# EasyEDA Pro project ProPrj_辅助电源模块_2026-01-25.epro

# Schematic 2023-A题-单相逆变器并联运行系统-106B电赛复兴团队
Board Name: 2023-A题-单相逆变器并联运行系统-106B电赛复兴团队; Create Date: 2025-06-02; Page Name: 辅助电源模块; Project Name: 辅助电源模块; Schematic Name: 2023-A题-单相逆变器并联运行系统-106B电赛复兴团队; Update Date: 2025-06-02; Add into BOM: yes; Company: Your Company; Convert to PCB: yes; Date: 2023-08-06; Draw By: interstellarone; REV: 1.0; Sheet: 1/1; spicePre: .
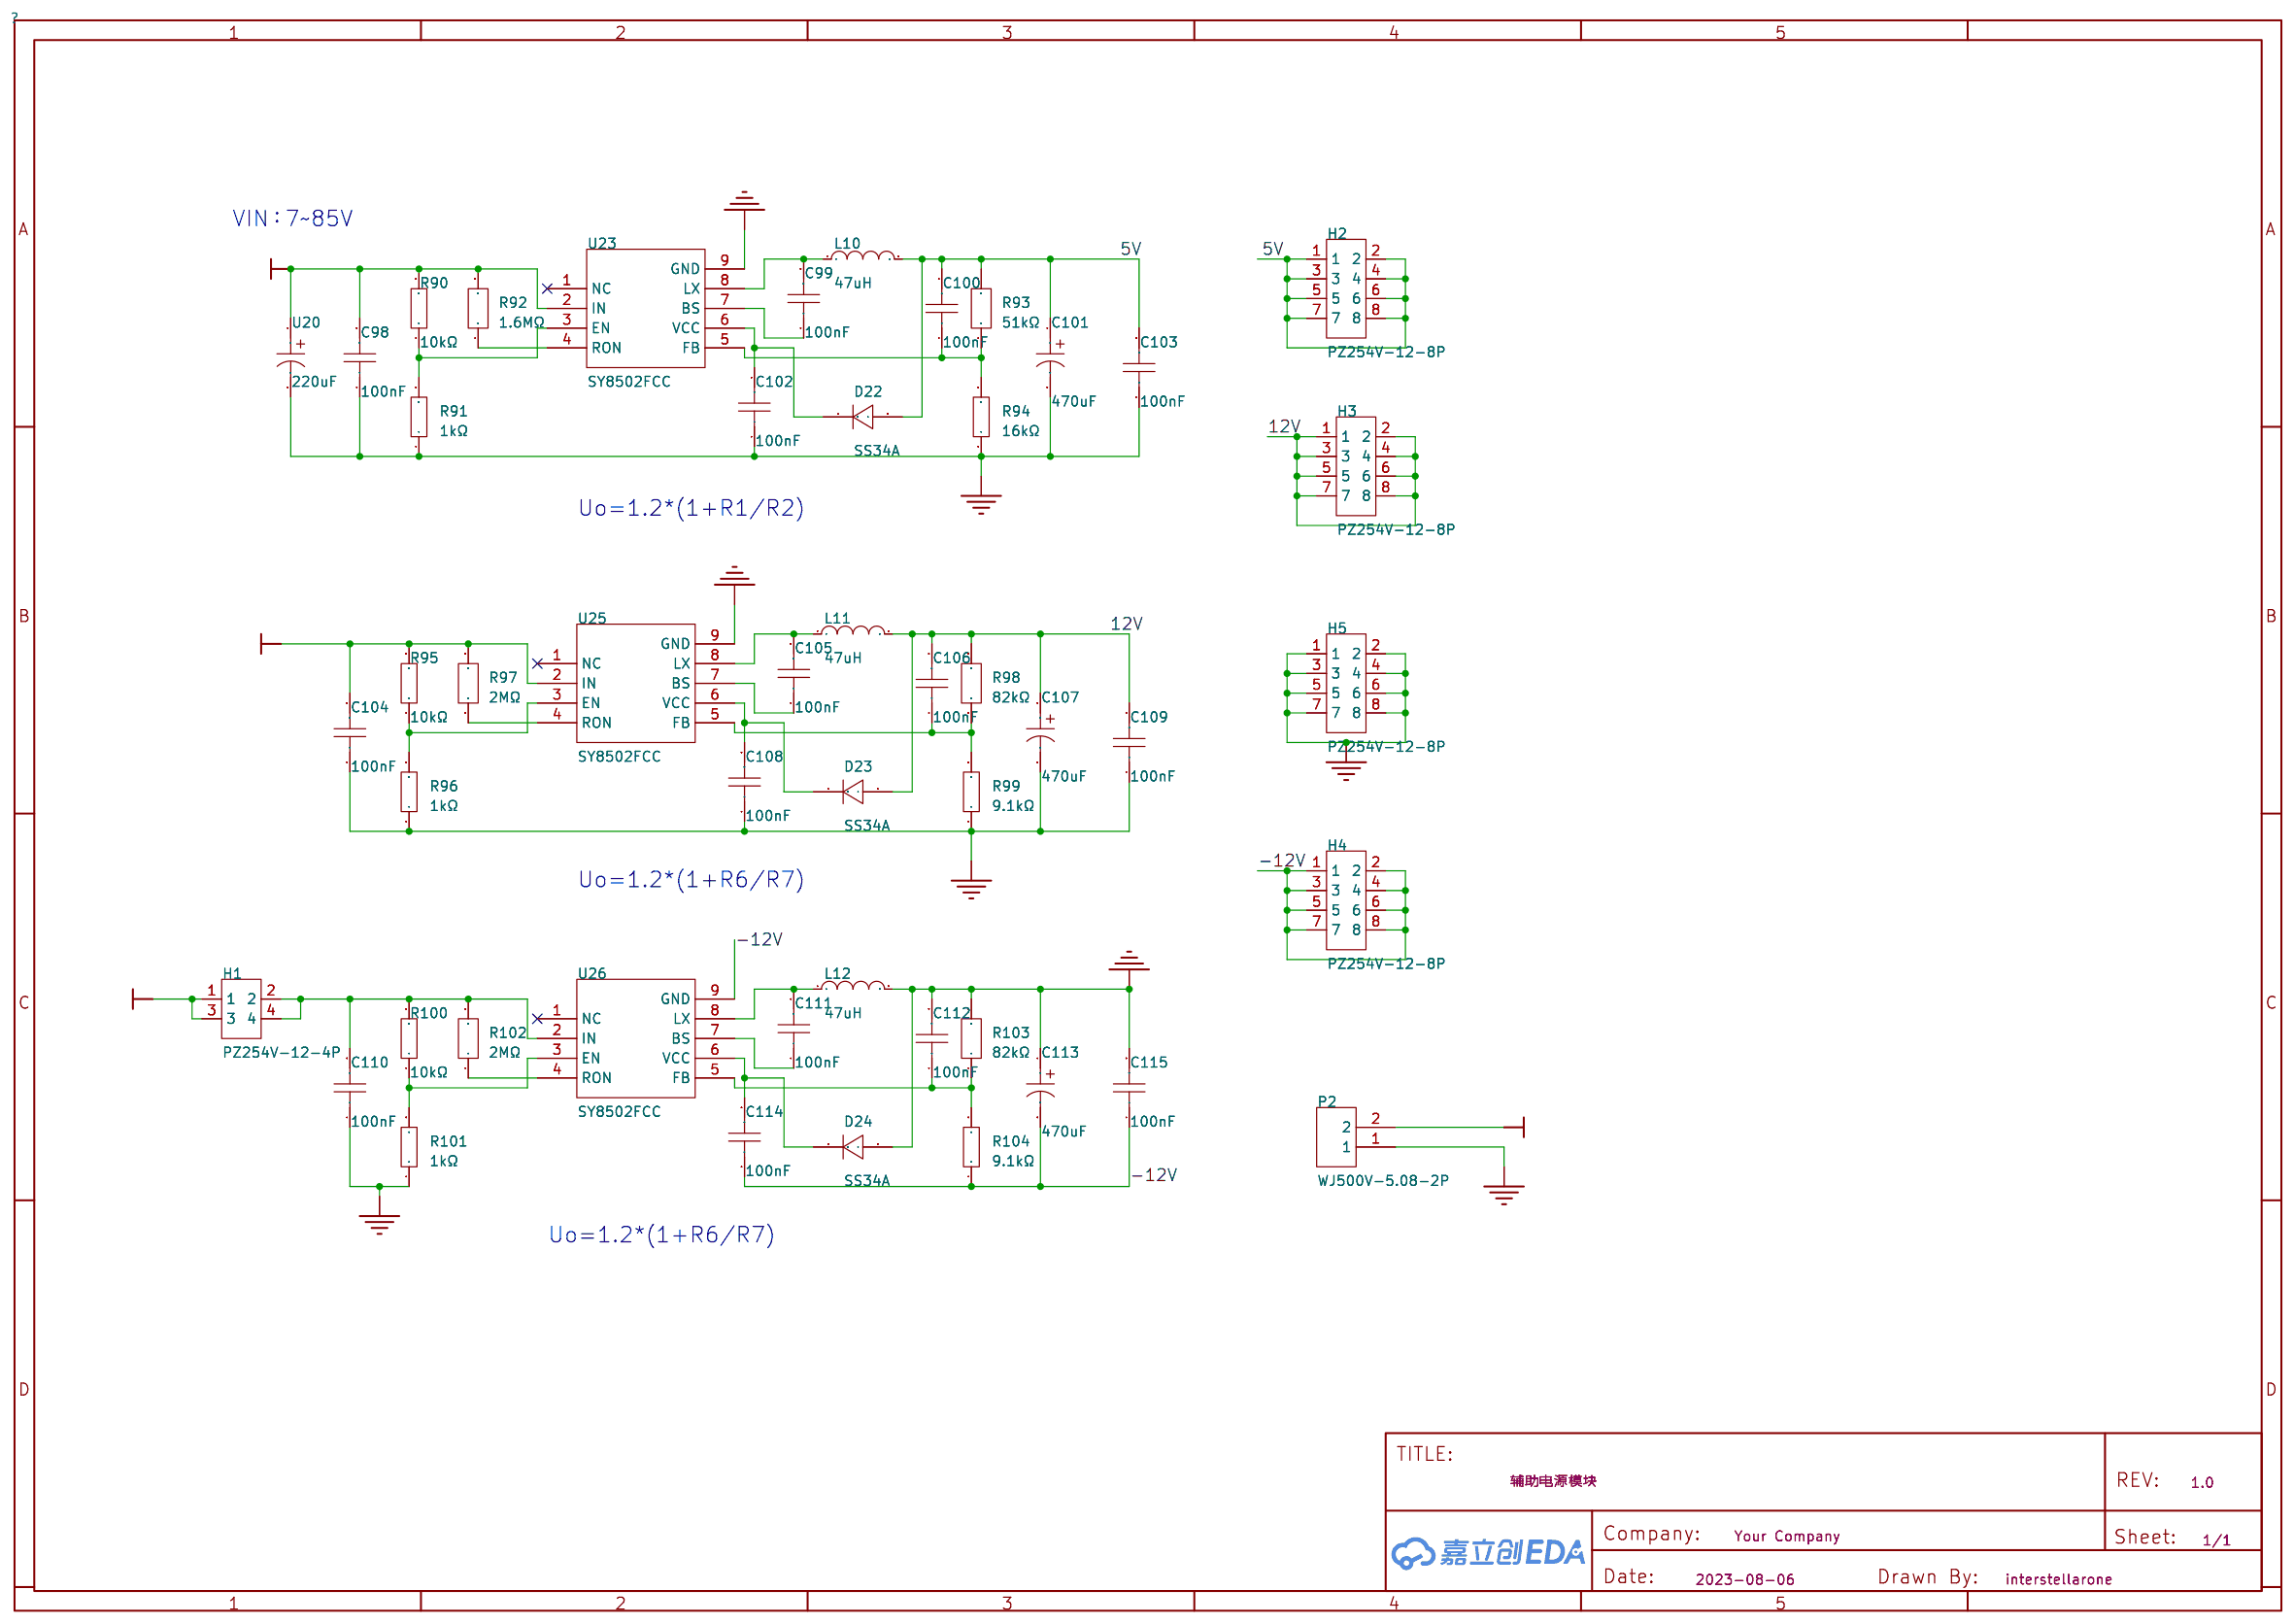
[diagram p0: schematic sheet]

## Parts
C98  100nF  [C0603]
C99  100nF  [C0603]
C100  100nF  [C0603]
C101  470uF  [CAP-TH_BD6.0-P2.50-D0.5-FD]
C102  100nF  [C0603]
C103  100nF  [C0603]
C104  100nF  [C0603]
C105  100nF  [C0603]
C106  100nF  [C0603]
C107  470uF  [CAP-TH_BD6.0-P2.50-D0.5-FD]
C108  100nF  [C0603]
C109  100nF  [C0603]
C110  100nF  [C0603]
C111  100nF  [C0603]
C112  100nF  [C0603]
C113  470uF  [CAP-TH_BD6.0-P2.50-D0.5-FD]
C114  100nF  [C0603]
C115  100nF  [C0603]
D22  SS34A  [SMA_L4.3-W2.6-LS5.2-RD]
D23  SS34A  [SMA_L4.3-W2.6-LS5.2-RD]
D24  SS34A  [SMA_L4.3-W2.6-LS5.2-RD]
H1  PZ254V-12-4P  [HDR-TH_4P-P2.54-V-M-R2-C2-S2.54]
H2  PZ254V-12-8P  [HDR-TH_8P-P2.54-V-M-R2-C4-S2.54]
H3  PZ254V-12-8P  [HDR-TH_8P-P2.54-V-M-R2-C4-S2.54]
H4  PZ254V-12-8P  [HDR-TH_8P-P2.54-V-M-R2-C4-S2.54]
H5  PZ254V-12-8P  [HDR-TH_8P-P2.54-V-M-R2-C4-S2.54]
L10  47uH  [IND-SMD_L7.0-W6.6_FXL0630]
L11  47uH  [IND-SMD_L7.0-W6.6_FXL0630]
L12  47uH  [IND-SMD_L7.0-W6.6_FXL0630]
P2  WJ500V-5.08-2P  [CONN-TH_2P-P5.00_WJ500V-5.08-2P]
R90  10kΩ  [R0603]
R91  1kΩ  [R0603]
R92  1.6MΩ  [R0603]
R93  51kΩ  [R0603]
R94  16kΩ  [R0603]
R95  10kΩ  [R0603]
R96  1kΩ  [R0603]
R97  2MΩ  [R0603]
R98  82kΩ  [R0603]
R99  9.1kΩ  [R0603]
R100  10kΩ  [R0603]
R101  1kΩ  [R0603]
R102  2MΩ  [R0603]
R103  82kΩ  [R0603]
R104  9.1kΩ  [R0603]
U20  220uF  [CAP-TH_BD12.5-P5.00-D0.6-FD]
U23  SY8502FCC  [SOIC-8_L4.9-W3.9-P1.27-LS6.0-BL-EP]
U25  SY8502FCC  [SOIC-8_L4.9-W3.9-P1.27-LS6.0-BL-EP]
U26  SY8502FCC  [SOIC-8_L4.9-W3.9-P1.27-LS6.0-BL-EP]

## Library data of the parts
C98-C100 C102-C106 C108-C112 C114 C115 = CGA0603X7R104K500JT: 容值:100nF;精度:±10%;额定电压:50V;温度系数:X7R;; LCSC Part Name: 100nF ±10% 50V; Supplier Part: C6119867; Manufacturer: HRE(芯声); Supplier Footprint: 0603; JLCPCB Part Class: 扩展库; Datasheet: https://atta.szlcsc.com/upload/public/pdf/source/20250103/C44077DA9E7B3EFAE02F22B6D3D1CBC9.pdf; Supplier: LCSC; Tolerance: ±10%; Voltage Rating: 50V; Temperature Coefficient: X7R
C101 C107 C113 = CD110477M1A0607VFL: 容值:470uF;额定电压:10V;; LCSC Part Name: 470uF 10V; Supplier Part: C7499930; Manufacturer: HRK(鸿瑞凯电子); Supplier Footprint: 插件,D6xL7mm; JLCPCB Part Class: 扩展库; Supplier: LCSC; Rated Voltage: 10V; φD: 6mm; L: 7mm
D22-D24 = SS34A_C211775: 正向压降(Vf):500mV@3A;直流反向耐压(Vr):40V;整流电流:3A;; LCSC Part Name: 电压:40V 电流:3A; Supplier Part: C211775; Manufacturer: YANGJIE(扬杰); Supplier Footprint: SMA(DO-214AC); JLCPCB Part Class: 扩展库; Datasheet: https://atta.szlcsc.com/upload/public/pdf/source/20221024/B9020E516EC6DC8CDE89FB2DDED1354C.pdf; Supplier: LCSC; Forward Voltage (Vf@If): 500mV@3A; Reverse Voltage (Vr): 40V; Rectified Current: 3A; Reverse Leakage Current (Ir): 500uA@40V
H1 = PZ254V-12-4P: 插针结构:2x2P;间距:2.54mm;行距:2.54mm;圆针/方针:方针;安装方式:直插;排数:双排;总PIN位数:4P;额定电流:-;额定电压:-;配合针长度:6mm;塑高:2.5mm;端接针长度:3mm;触头材质:黄铜;触头镀层:-;工作温度:-40℃~+105℃;颜色:黑色;; LCSC Part Name: 2x2P 间距:2.54mm 方针 直插; Supplier Part: C492419; Manufacturer: XFCN(兴飞); Supplier Footprint: 插件,P=2.54mm; JLCPCB Part Class: 扩展库; Datasheet: https://atta.szlcsc.com/upload/public/pdf/source/20200309/C492419_0001C06E73AFF21BD0ED3D7CEEF46D29.pdf; Supplier: LCSC; Pin Structure: 2x2P; Pitch: 2.54mm; Row Spacing: 2.54mm; Circluar Pins/Square Pins: 方针; Mounting Type: 直插; Number of Rows: 双排; Number of Pins: 4P; Length of Mating Pin: 6mm; Insulation Height: 2.5mm; Length of End Connection Pin: 3mm; Contact Material: 黄铜; Operating Temperature: -40℃~+105℃; Color: 黑色
H2-H5 = PZ254V-12-8P: 插针结构:2x4P;间距:2.54mm;行距:2.54mm;圆针/方针:方针;安装方式:直插;排数:双排;总PIN位数:8P;额定电流:-;额定电压:-;配合针长度:6mm;塑高:2.5mm;端接针长度:3mm;触头材质:黄铜;触头镀层:-;工作温度:-40℃~+105℃;颜色:黑色;; LCSC Part Name: 2x4P 间距:2.54mm 方针 直插; Supplier Part: C492421; Manufacturer: XFCN(兴飞); Supplier Footprint: 插件,P=2.54mm; JLCPCB Part Class: 扩展库; Datasheet: https://atta.szlcsc.com/upload/public/pdf/source/20200309/C492421_DC8A206AF99CD7755BD4A5B0BC48200B.pdf; Supplier: LCSC; Pin Structure: 2x4P; Pitch: 2.54mm; Row Spacing: 2.54mm; Circluar Pins/Square Pins: 方针; Mounting Type: 直插; Number of Rows: 双排; Number of Pins: 8P; Length of Mating Pin: 6mm; Insulation Height: 2.5mm; Length of End Connection Pin: 3mm; Contact Material: 黄铜; Operating Temperature: -40℃~+105℃; Color: 黑色
L10-L12 = FXL0630-470-M: 电感值:47uH;精度:±20%;额定电流:1.5A;饱和电流(Isat):2A;类型:一体成型电感;; LCSC Part Name: 47uH ±20% 2A; Supplier Part: C475913; Manufacturer: cjiang(长江微电); Supplier Footprint: SMD,6.6x7mm; JLCPCB Part Class: 扩展库; Datasheet: https://atta.szlcsc.com/upload/public/pdf/source/20240426/3189EA8206330E2108542F9E34E540E7.pdf; Supplier: LCSC; Tolerance: ±20%; Rated Current: 1.5A; Saturation Current (Isat): 2A; DC Resistance (DCR): 385mΩ; Type: 一体成型电感
P2 = WJ500V-5.08-2P: 结构:1x2P;间距:5.08mm;颜色:绿色;安装方式:直插;额定电流:18A;额定电压:250V;排数:1;线规 - AWG:14~30;线规 - 平方毫米:2.5;每排PIN数:2;触头材质:-;触头镀层:-;工作温度范围:-40℃~+105℃;焊接温度(最大值):-;; LCSC Part Name: 1x2P 5.08mm 直插 排数:1 每排P数:2; Supplier Part: C8465; Manufacturer: KANGNEX(康奈克斯电气); Supplier Footprint: 插件,P=5.08mm; JLCPCB Part Class: 扩展库; Datasheet: https://atta.szlcsc.com/upload/public/pdf/source/20191225/C8465_02D34CE5B5B4A53DF5891601D97FA9F4.pdf; Supplier: LCSC; Structure: 1x2P; Pitch: 5.08mm; Color: 绿色; Mounting Style: 直插; Current Rating (Max): 18A; Voltage Rating (Max): 250V; Number of Pins: 2P; Number of Rows: 1; Wire Gauge - AWG: 14~30; Wire Gauge - mm2: 2.5; Number of PINs Per Row: 2; Operating Temperature Range: -40℃~+105℃; Screw Specification: M2.5
R90 R95 R100 = 0603WAF1002T5E: 电阻类型:厚膜电阻;阻值:10kΩ;精度:±1%;功率:100mW;最大工作电压:75V;温度系数:±100ppm/℃;; LCSC Part Name: 厚膜电阻 10kΩ ±1% 100mW; Supplier Part: C25804; Manufacturer: UNI-ROYAL(厚声); Supplier Footprint: 0603; JLCPCB Part Class: 基础库; Datasheet: https://atta.szlcsc.com/upload/public/pdf/source/20200306/C422600_1E6D84923E4A46A82E41ADD87F860B5C.pdf; Supplier: LCSC; Type: 厚膜电阻; Tolerance: ±1%; Power(Watts): 100mW; Overload Voltage (Max): 75V; Temperature Coefficient: ±100ppm/℃; Operating Temperature Range: -55℃~+155℃
R91 R96 R101 = 0603WAF1001T5E: 电阻类型:厚膜电阻;阻值:1kΩ;精度:±1%;功率:100mW;最大工作电压:75V;温度系数:±100ppm/℃;; LCSC Part Name: 1kΩ ±1% 100mW 厚膜电阻; Supplier Part: C21190; Manufacturer: UNI-ROYAL(厚声); Supplier Footprint: 0603; JLCPCB Part Class: 基础库; Datasheet: https://atta.szlcsc.com/upload/public/pdf/source/20200306/C422600_1E6D84923E4A46A82E41ADD87F860B5C.pdf; Supplier: LCSC; Type: 厚膜电阻; Tolerance: ±1%; Power(Watts): 100mW; Overload Voltage (Max): 75V; Temperature Coefficient: ±100ppm/℃; Operating Temperature Range: -55℃~+155℃
R92 R97 R102 = FRC0603J165 TS: 电阻类型:厚膜电阻;阻值:1.6MΩ;精度:±5%;功率:100mW;最大工作电压:75V;温度系数:±100ppm/℃;; LCSC Part Name: 1.6MΩ ±5% 100mW 厚膜电阻; Supplier Part: C2933272; Manufacturer: FOJAN(富捷); Supplier Footprint: 0603; JLCPCB Part Class: 扩展库; Datasheet: https://atta.szlcsc.com/upload/public/pdf/source/20211221/925EC7D7225764EE0046F22065062C87.pdf; Supplier: LCSC; Type: 厚膜电阻; Tolerance: ±5%; Power(Watts): 100mW; Overload Voltage (Max): 75V; Temperature Coefficient: ±100ppm/℃; Operating Temperature Range: -55℃~+155℃
R93 R98 R103 = FRC0603F5102TS: 电阻类型:厚膜电阻;阻值:51kΩ;精度:±1%;功率:100mW;最大工作电压:75V;温度系数:±100ppm/℃;; LCSC Part Name: 51kΩ ±1% 100mW 厚膜电阻; Supplier Part: C2907049; Manufacturer: FOJAN(富捷); Supplier Footprint: 0603; JLCPCB Part Class: 扩展库; Datasheet: https://atta.szlcsc.com/upload/public/pdf/source/20211221/925EC7D7225764EE0046F22065062C87.pdf; Supplier: LCSC; Type: 厚膜电阻; Tolerance: ±1%; Power(Watts): 100mW; Overload Voltage (Max): 75V; Temperature Coefficient: ±100ppm/℃; Operating Temperature Range: -55℃~+155℃
R94 R99 R104 = 0603WAF1602T5E: 电阻类型:厚膜电阻;阻值:16kΩ;精度:±1%;功率:100mW;最大工作电压:75V;温度系数:±100ppm/℃;; LCSC Part Name: 16kΩ ±1% 100mW 厚膜电阻; Supplier Part: C4210; Manufacturer: UNI-ROYAL(厚声); Supplier Footprint: 0603; JLCPCB Part Class: 扩展库; Datasheet: https://atta.szlcsc.com/upload/public/pdf/source/20200306/C422600_1E6D84923E4A46A82E41ADD87F860B5C.pdf; Supplier: LCSC; Type: 厚膜电阻; Tolerance: ±1%; Power(Watts): 100mW; Overload Voltage (Max): 75V; Temperature Coefficient: ±100ppm/℃; Operating Temperature Range: -55℃~+155℃
U20 = ERJ1KM221W20OT: 容值:220uF;精度:±20%;额定电压:100V;; LCSC Part Name: 220uF ±20% 100V; Supplier Part: C5213780; Manufacturer: AISHI(艾华集团); Supplier Footprint: 插件,D12.5xL20mm; JLCPCB Part Class: 扩展库; Datasheet: https://atta.szlcsc.com/upload/public/pdf/source/20221026/FE9DE5870E7BB63CB4D24A5A37C2EC23.pdf; Supplier: LCSC; Tolerance: ±20%; Rated Voltage: 100V; Lead Spacing: 5mm; φD: 12.5mm; L: 20mm; Lifetime @ Temp: 10000hrs@105℃
U23 U25 U26 = SY8502FCC: 功能类型:降压型;输出类型:固定;工作电压:7V~85V;输出电压:5V;输出电流:1.2A;; LCSC Part Name: 高效率1.2A连续输出85V输入同步降压转换器; Supplier Part: C87752; Manufacturer: silergy(矽力杰); Supplier Footprint: SOIC-8-EP; JLCPCB Part Class: 扩展库; Datasheet: https://atta.szlcsc.com/upload/public/pdf/source/20170925/C87752_1506321754501990561.pdf; Supplier: LCSC; Function: 降压型; Output Type: 固定; Input Voltage: 7V~85V; Output Voltage: 5V; Output Current: 1.2A; Switching Frequency: 200kHz~500kHz; Operating Temperature: -40℃~+125℃; Synchronous Rectification: 是; Number of Outputs: 1; Topology: 降压式; Quiescent Current (Iq): 400uA; Switch tube (built-in/external): 内置

## Nets
5V: C100.2 C101.1 C103.2 D22.2(A) H2.1 H2.2 H2.3 H2.4 H2.5 H2.6 H2.7 H2.8 L10.2 R93.2
12V: C106.2 C107.1 C109.2 D23.2(A) H3.1 H3.2 H3.3 H3.4 H3.5 H3.6 H3.7 H3.8 L11.2 R98.2
-12V: C113.2 C114.1 C115.1 H4.1 H4.2 H4.3 H4.4 H4.5 H4.6 H4.7 H4.8 R104.1 U26.9(GND)
GND: C98.1 C101.2 C102.1 C103.1 C104.1 C107.2 C108.1 C109.1 C110.1 C112.2 C113.1 C115.2 D24.2(A) H5.1 H5.2 H5.3 H5.4 H5.5 H5.6 H5.7 H5.8 L12.2 P2.1 R91.1 R94.1 R96.1 R99.1 R101.1 R103.2 U20.2 U23.9(GND) U25.9(GND)
VCC: C98.2 C104.2 H1.1 H1.3 P2.2 R90.2 R92.2 R95.2 R97.2 U20.1 U23.2(IN) U25.2(IN)
$1N26: R90.1 R91.2 U23.3(EN)
$1N27: R92.1 U23.4(RON)
$1N28: C99.2 L10.1 U23.8(LX)
$1N29: C99.1 U23.7(BS)
$1N31: C100.1 R93.1 R94.2 U23.5(FB)
$1N33: C102.2 D22.1(C) U23.6(VCC)
$1N4459: R97.1 U25.4(RON)
$1N4462: C105.2 L11.1 U25.8(LX)
$1N4464: C105.1 U25.7(BS)
$1N4465: C106.1 R98.1 R99.2 U25.5(FB)
$1N4466: C108.2 D23.1(C) U25.6(VCC)
$1N4470: R95.1 R96.2 U25.3(EN)
$1N5629: R102.1 U26.4(RON)
$1N5632: C111.2 L12.1 U26.8(LX)
$1N5634: C111.1 U26.7(BS)
$1N5635: C112.1 R103.1 R104.2 U26.5(FB)
$1N5636: C114.2 D24.1(C) U26.6(VCC)
$1N5640: R100.1 R101.2 U26.3(EN)
$1N5739: C110.2 H1.2 H1.4 R100.2 R102.2 U26.2(IN)

Not connected (* = marked no-connect by the designer): U23 1(NC)*; U25 1(NC)*; U26 1(NC)*

## Notes on the sheet
- VIN：7~85V
- Uo=1.2*(1+R1/R2)
- Uo=1.2*(1+R6/R7)
- Uo=1.2*(1+R6/R7)

# Board 1. 辅助电源模块
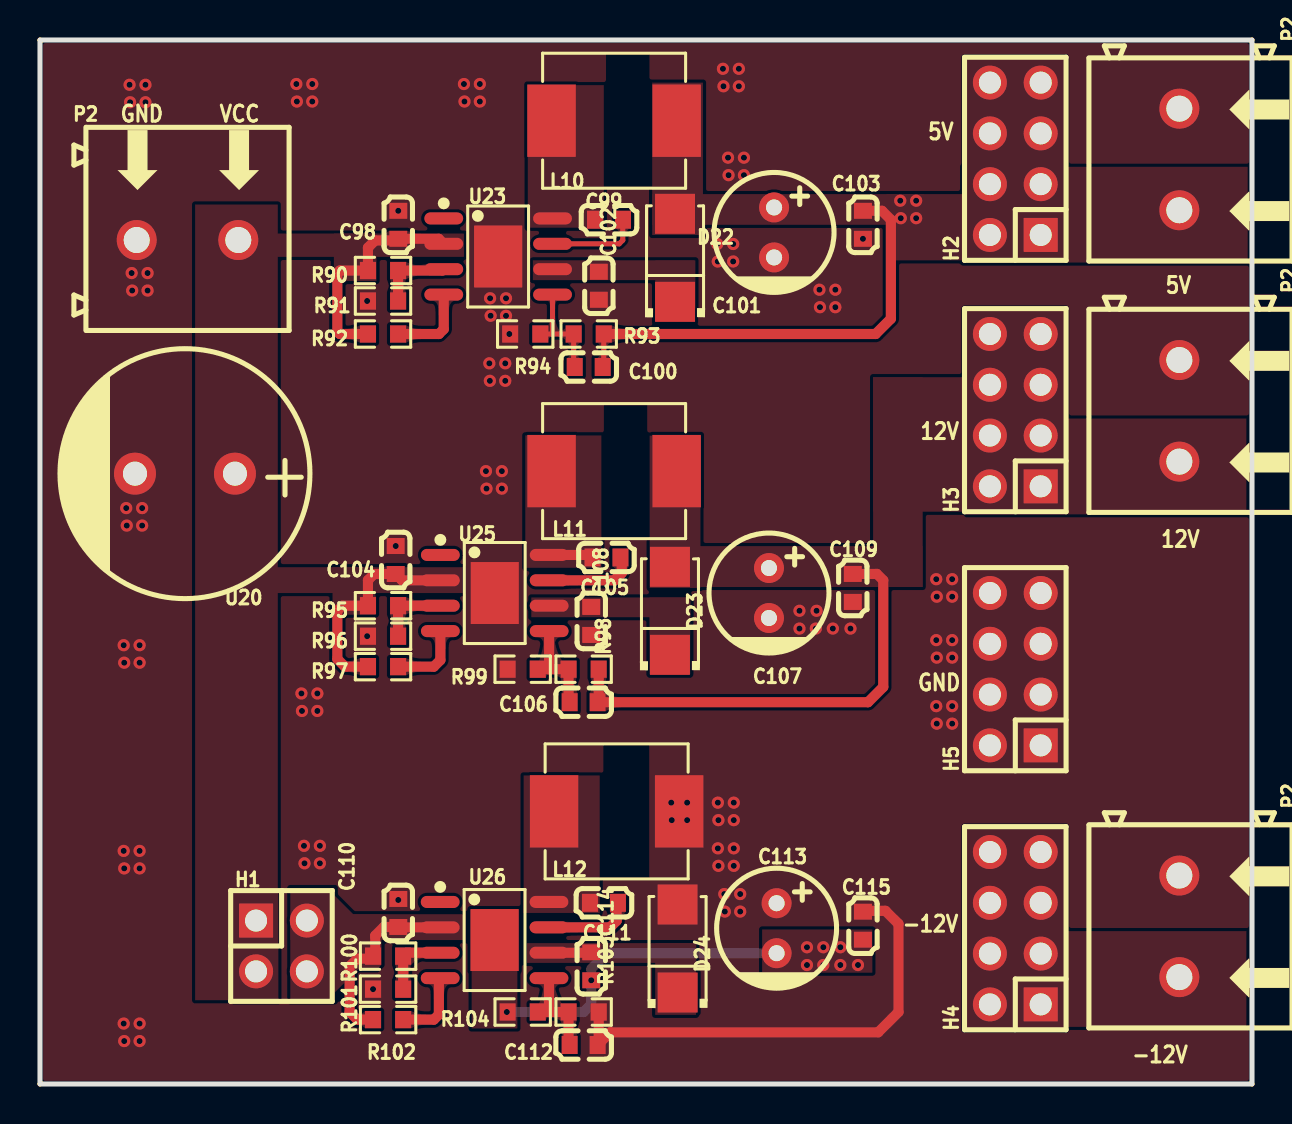
[diagram p1: board, top side]
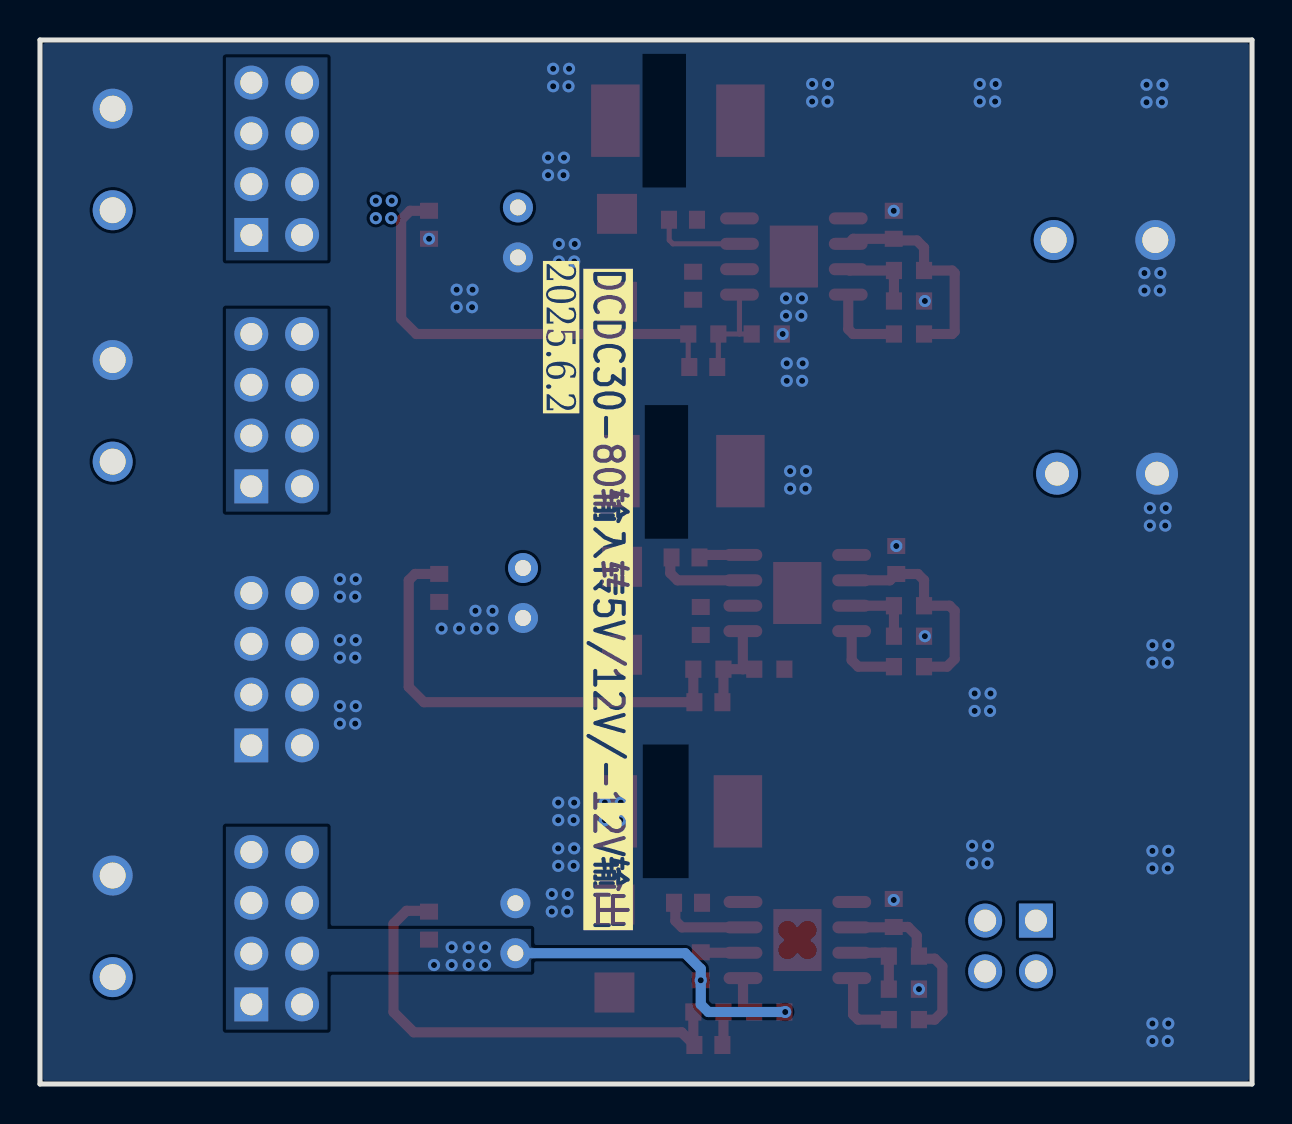
[diagram p2: board, bottom side, seen from below]

Outline 60.62 x 52.22 mm; copper layers: Top Layer, Bottom Layer. Coordinates in mm from the lower left corner of the outline.
Outline path: 0,52.22 60.62,52.22 60.62,0 0,0 0,52.22
Stack: Top Layer 0.035mm / Dielectric1 1.51mm FR4 er 4.5 / Bottom Layer 0.035mm

## Design rules (mm)
template: 用户自定义配置
spacing Default (default): track to track 0.152, other pairs 0 to 0.152
track width Default (default): min 0.254, default 0.254, max 25.4
differential pair differentialPair (default): width min 0.127, default 0.254, max 2.54; gap min 0.152, default 0.152
via Default (default): diameter min 0.61, default 0.61, max 100.025; hole min 0.305, default 0.305, max 59.995

## Placement (name value [footprint] x y rotation side)
C98  100nF  [C0603]  17.92 42.97 270 top
C99  100nF  [C0603]  28.46 43.23 180 top
C100  100nF  [C0603]  27.44 35.86 0 top
C101  470uF  [CAP-TH_BD6.0-P2.50-D0.5-FD]  36.72 42.59 270 top
C102  100nF  [C0603]  27.95 39.92 90 top
C103  100nF  [C0603]  41.16 42.97 90 top
C104  100nF  [C0603]  17.79 26.21 270 top
C105  100nF  [C0603]  28.33 26.33 180 top
C106  100nF  [C0603]  27.19 19.1 0 top
C107  470uF  [CAP-TH_BD6.0-P2.50-D0.5-FD]  36.46 24.56 270 top
C108  100nF  [C0603]  27.57 23.16 90 top
C109  100nF  [C0603]  40.65 24.81 90 top
C110  100nF  [C0603]  17.92 8.55 270 top
C111  100nF  [C0603]  28.21 9.06 180 top
C112  100nF  [C0603]  27.19 1.95 0 top
C113  470uF  [CAP-TH_BD6.0-P2.50-D0.5-FD]  36.84 7.79 270 top
C114  100nF  [C0603]  27.57 5.89 90 top
C115  100nF  [C0603]  41.16 7.92 90 top
D22  SS34A  [SMA_L4.3-W2.6-LS5.2-RD]  31.76 41.32 90 top
D23  SS34A  [SMA_L4.3-W2.6-LS5.2-RD]  31.51 23.67 90 top
D24  SS34A  [SMA_L4.3-W2.6-LS5.2-RD]  31.89 6.78 90 top
H1  PZ254V-12-4P  [HDR-TH_4P-P2.54-V-M-R2-C2-S2.54]  12.08 6.9 270 top
H2  PZ254V-12-8P  [HDR-TH_8P-P2.54-V-M-R2-C4-S2.54]  48.78 46.27 90 top
H3  PZ254V-12-8P  [HDR-TH_8P-P2.54-V-M-R2-C4-S2.54]  48.78 33.7 90 top
H4  PZ254V-12-8P  [HDR-TH_8P-P2.54-V-M-R2-C4-S2.54]  48.78 7.79 90 top
H5  PZ254V-12-8P  [HDR-TH_8P-P2.54-V-M-R2-C4-S2.54]  48.78 20.75 90 top
L10  47uH  [IND-SMD_L7.0-W6.6_FXL0630]  28.71 48.18 180 top
L11  47uH  [IND-SMD_L7.0-W6.6_FXL0630]  28.71 30.65 180 top
L12  47uH  [IND-SMD_L7.0-W6.6_FXL0630]  28.84 13.63 180 top
P2  WJ500V-5.08-2P  [CONN-TH_2P-P5.00_WJ500V-5.08-2P]  56.98 7.89 270 top
P2#2  -  [CONN-TH_2P-P5.00_WJ500V-5.08-2P]  7.38 42.21 0 top
P2#3  -  [CONN-TH_2P-P5.00_WJ500V-5.08-2P]  56.98 46.24 270 top
P2#4  -  [CONN-TH_2P-P5.00_WJ500V-5.08-2P]  56.98 33.67 270 top
R90  10kΩ  [R0603]  17.16 40.69 180 top
R91  1kΩ  [R0603]  17.16 39.16 0 top
R92  1.6MΩ  [R0603]  17.16 37.51 180 top
R93  51kΩ  [R0603]  27.44 37.51 0 top
R94  16kΩ  [R0603]  24.27 37.51 0 top
R95  10kΩ  [R0603]  17.16 23.92 180 top
R96  1kΩ  [R0603]  17.16 22.4 0 top
R97  2MΩ  [R0603]  17.16 20.87 180 top
R98  82kΩ  [R0603]  27.19 20.75 0 top
R99  9.1kΩ  [R0603]  24.14 20.75 0 top
R100  10kΩ  [R0603]  17.41 6.4 180 top
R101  1kΩ  [R0603]  17.41 4.74 0 top
R102  2MΩ  [R0603]  17.41 3.22 180 top
R103  82kΩ  [R0603]  27.19 3.6 0 top
R104  9.1kΩ  [R0603]  24.14 3.6 0 top
U20  220uF  [CAP-TH_BD12.5-P5.00-D0.6-FD]  7.25 30.53 180 top
U23  SY8502FCC  [SOIC-8_L4.9-W3.9-P1.27-LS6.0-BL-EP]  22.92 41.39 270 top
U25  SY8502FCC  [SOIC-8_L4.9-W3.9-P1.27-LS6.0-BL-EP]  22.75 24.56 270 top
U26  SY8502FCC  [SOIC-8_L4.9-W3.9-P1.27-LS6.0-BL-EP]  22.74 7.2 270 top

## Footprints (pads in the part's own frame, mm; a bottom-side part is the same pattern mirrored in y, then rotated)
C0603
  rect 0.8x0.9 smd: 1(-0.7,0) 2(0.7,0)
CAP-TH_BD6.0-P2.50-D0.5-FD
  round 1.5 hole 0.8: 1(-1.25,0) 2(1.25,0)
CAP-TH_BD12.5-P5.00-D0.6-FD
  round 2.1 hole 1.2: 1(-2.5,0) 2(2.5,0)
CONN-TH_2P-P5.00_WJ500V-5.08-2P
  round 2 hole 1.3: 1(-2.54,0) 2(2.54,0)
HDR-TH_4P-P2.54-V-M-R2-C2-S2.54
  rect 1.7x1.7 hole 1.1: 1(-1.27,-1.27)
  round 1.7 hole 1.1: 2(-1.27,1.27) 3(1.27,-1.27) 4(1.27,1.27)
HDR-TH_8P-P2.54-V-M-R2-C4-S2.54
  rect 1.7x1.7 hole 1.1: 1(-3.81,-1.27)
  round 1.7 hole 1.1: 2(-3.81,1.27) 3(-1.27,-1.27) 4(-1.27,1.27) 5(1.27,-1.27) 6(1.27,1.27) 7(3.81,-1.27) 8(3.81,1.27)
IND-SMD_L7.0-W6.6_FXL0630
  rect 2.424x3.62 smd: 1(3.128,0) 2(-3.128,0)
R0603
  rect 0.806x0.864 smd: 1(-0.753,0) 2(0.753,0)
SMA_L4.3-W2.6-LS5.2-RD
  rect 2x2 smd: 1(-2.2,0) 2(2.2,0)
SOIC-8_L4.9-W3.9-P1.27-LS6.0-BL-EP
  oval 0.602x1.941 smd: 1(-1.905,-2.72) 2(-0.635,-2.72) 3(0.635,-2.72) 4(1.905,-2.72) 5(1.905,2.72) 6(0.635,2.72) 7(-0.635,2.72) 8(-1.905,2.72)
  rect 3.098x2.41 smd: 9(0,0)

## Nets
5V: C100.2 C101.1 C103.2 D22.2 H2.1 H2.2 H2.3 H2.4 H2.5 H2.6 H2.7 H2.8 L10.2 P2#3.2 R93.2
12V: C106.2 C107.1 C109.2 D23.2 H3.1 H3.2 H3.3 H3.4 H3.5 H3.6 H3.7 H3.8 L11.2 P2#4.2 R98.2
-12V: C113.2 C114.1 C115.1 H4.1 H4.2 H4.3 H4.4 H4.5 H4.6 H4.7 H4.8 P2.2 R104.1 U26.9
GND: C98.1 C101.2 C102.1 C103.1 C104.1 C107.2 C108.1 C109.1 C110.1 C112.2 C113.1 C115.2 D24.2 H5.1 H5.2 H5.3 H5.4 H5.5 H5.6 H5.7 H5.8 L12.2 P2.1 P2#2.1 P2#3.1 P2#4.1 R91.1 R94.1 R96.1 R99.1 R101.1 R103.2 U20.2 U23.9 U25.9
VCC: C98.2 C104.2 H1.1 H1.3 P2#2.2 R90.2 R92.2 R95.2 R97.2 U20.1 U23.2 U25.2
$1N26: R90.1 R91.2 U23.3
$1N27: R92.1 U23.4
$1N28: C99.2 L10.1 U23.8
$1N29: C99.1 U23.7
$1N31: C100.1 R93.1 R94.2 U23.5
$1N33: C102.2 D22.1 U23.6
$1N4459: R97.1 U25.4
$1N4462: C105.2 L11.1 U25.8
$1N4464: C105.1 U25.7
$1N4465: C106.1 R98.1 R99.2 U25.5
$1N4466: C108.2 D23.1 U25.6
$1N4470: R95.1 R96.2 U25.3
$1N5629: R102.1 U26.4
$1N5632: C111.2 L12.1 U26.8
$1N5634: C111.1 U26.7
$1N5635: C112.1 R103.1 R104.2 U26.5
$1N5636: C114.2 D24.1 U26.6
$1N5640: R100.1 R101.2 U26.3
$1N5739: C110.2 H1.2 H1.4 R100.2 R102.2 U26.2

Pads without a net: U23 1; U25 1; U26 1

## Via types
v1: diameter 0.61, hole 0.305, Top Layer to Bottom Layer, 123 vias

## Routing (per net, layer and track width the routed paths; a pad name or vN(x,y) marks a point on that pad's centre or on a via; arc(x,y) is an arc through that point)
5V: length 22.9
  Top Layer w0.254: 28.14,35.86 28.2,35.91 R93.2
  Top Layer w0.508: R93.2 41.8,37.51 42.56,38.27 42.56,43.23 42.11,43.67 C103.2
  vias: v1(43.03,44.18) v1(43.05,43.3) v1(43.82,44.18) v1(43.82,43.3)
12V: length 23.3
  Top Layer w0.508: R98.2 27.94,19.15 C106.2 41.41,19.1 42.18,19.86 42.18,25.19 41.86,25.51 40.65,25.51
-12V: length 15.8
  Bottom Layer w0.508: v1(23.35,3.6) 27.19,3.6 27.57,3.98 v1(27.57,5.19) 27.57,5.76 28.35,6.54 C113.2
  vias: v1(38.36,6.84) v1(38.36,5.95) v1(39.18,6.84) v1(39.18,5.95) v1(40.03,6.84) v1(40.03,5.95) v1(40.91,5.95)
GND: length 23.8
  Top Layer w0.508: C115.2 41.2,8.66 42.29,8.66 42.94,8.01 42.94,3.6 41.92,2.59 28.53,2.59 27.94,2 ; R103.2 27.94,2 ; 27.94,2 C112.2
  vias: v1(4.19,21.95) v1(4.21,21.07) v1(4.19,11.66) v1(4.21,10.78) v1(4.19,3.02) v1(4.21,2.15) v1(4.31,28.8) v1(4.34,27.93) v1(4.48,49.97) v1(4.51,49.1) v1(4.58,40.56) v1(4.61,39.68) v1(4.98,21.95) v1(4.98,21.07) v1(4.98,11.66) v1(4.98,10.78) v1(4.98,3.02) v1(4.98,2.15) v1(5.11,28.8) v1(5.11,27.93) v1(5.28,49.97) v1(5.28,49.1) v1(5.38,40.56) v1(5.38,39.68) v1(12.82,50.01) v1(12.85,49.14) v1(13.08,19.53) v1(13.1,18.66) v1(13.2,11.91) v1(13.23,11.04) v1(13.62,50.01) v1(13.62,49.14) v1(13.87,19.53) v1(13.87,18.66) v1(14,11.91) v1(14,11.04) v1(16.36,39.16) v1(16.36,22.4) v1(16.66,4.74) v1(17.79,26.91) v1(17.92,43.67) v1(17.92,9.2) v1(21.2,50.01) v1(21.23,49.14) v1(22,50.01) v1(22,49.14) v1(22.3,30.65) v1(22.33,29.78) v1(22.51,39.3) v1(22.47,36.04) v1(22.5,35.17) v1(22.54,38.42) v1(23.1,30.65) v1(23.1,29.78) v1(23.31,39.3) v1(23.31,38.42) v1(23.27,36.04) v1(23.27,35.17) v1(23.47,37.51) v1(31.57,14.07) v1(31.6,13.2) v1(32.37,14.07) v1(32.37,13.2) v1(33.87,42.01) v1(33.9,41.14) v1(33.9,14.07) v1(33.9,11.79) v1(33.93,13.2) v1(33.93,10.91) v1(34.16,50.78) v1(34.18,49.9) v1(34.23,9.5) v1(34.25,8.62) v1(34.41,46.33) v1(34.44,45.45) v1(34.67,42.01) v1(34.67,41.14) v1(34.7,14.07) v1(34.7,13.2) v1(34.7,11.79) v1(34.7,10.91) v1(34.95,50.78) v1(34.95,49.9) v1(35.02,9.5) v1(35.02,8.62) v1(35.21,46.33) v1(35.21,45.45) v1(37.99,23.67) v1(37.99,22.78) v1(38.8,22.78) v1(38.84,23.67) v1(38.98,39.73) v1(39.01,38.85) v1(39.65,22.78) v1(39.78,39.73) v1(39.78,38.85) v1(40.54,22.78) v1(41.16,42.27) v1(44.83,25.25) v1(44.83,22.2) v1(44.83,18.9) v1(44.85,24.37) v1(44.85,21.33) v1(44.85,18.02) v1(45.62,25.25) v1(45.62,24.37) v1(45.62,22.2) v1(45.62,21.33) v1(45.62,18.9) v1(45.62,18.02)
VCC: length 22.2
  Top Layer w0.508: R92.2 15,37.51 14.87,37.64 14.87,40.56 15,40.69 R90.2 16.4,41.83 16.76,42.19 17.84,42.19 C98.2 19.94,42.27 20.19,42.02 ; R97.2 15.25,20.87 14.87,21.25 14.87,23.67 15.13,23.92 R95.2 16.4,25.2 16.71,25.51 C104.2 18.11,25.19 U25.2
$1N26: length 3.8
  Top Layer w0.508: 20.19,40.75 20.13,40.69 R90.1 R91.2
$1N27: length 4.1
  Top Layer w0.508: 20.19,39.48 20.19,37.75 19.95,37.51 R92.1
$1N29: length 4.6
  Top Layer w0.254: U23.7 28.97,42.02 29.15,42.2 29.15,43.21 29.16,43.23
$1N31: length 5.3
  Top Layer w0.254: C100.1 26.69,35.91 R93.1 25.64,37.51 ; R94.2 25.64,37.51 ; 25.64,37.51 U23.5
$1N4459: length 3.7
  Top Layer w0.508: R97.1 19.7,20.87 20.02,21.2 U25.4
$1N4462: length 2.2
  Top Layer w0.508: U25.8 27.51,26.46 C105.2
$1N4464: length 4.6
  Top Layer w0.508: C105.1 29.1,26.27 29.1,25.55 28.74,25.19 U25.7
$1N4465: length 5.1
  Top Layer w0.508: 25.47,20.75 R99.2 ; 25.47,20.75 R98.1 26.44,19.15 26.49,19.1 ; 25.47,20.75 U25.5
$1N4470: length 3.6
  Top Layer w0.508: R96.2 R95.1 U25.3
$1N5629: length 3.7
  Top Layer w0.508: R102.1 19.7,3.22 19.95,3.47 19.95,5.23 U26.4
$1N5634: length 4.4
  Top Layer w0.508: C111.1 28.84,9 28.84,8.16 28.51,7.83 U26.7
$1N5635: length 4.9
  Top Layer w0.508: 25.41,3.6 R103.1 26.44,2 26.49,1.95 ; 25.41,3.6 R104.2 ; 25.41,3.6 25.46,3.65 U26.5
$1N5636: length 2.1
  Top Layer w0.508: C114.2 27.55,6.56 U26.6
$1N5640: length 3.6
  Top Layer w0.508: U26.3 18.33,6.56 R100.1 R101.2
$1N5739: length 9.6
  Top Layer w0.508: R102.2 15.87,3.22 15.49,3.6 15.49,5.89 15.87,6.27 16.77,6.27 16.77,7.42 17.2,7.85 C110.2 17.94,7.83 U26.2

## Copper pours and planes (outline as drawn; the poured copper is in the pictures)
5V on Top Layer: 46.17,45.87 60.4,45.87 60.4,41.08 46.17,41.08
5V on Top Layer: 42.35,44.51 51.32,44.51 51.32,41.19 42.35,41.19
5V on Top Layer: 30.62,50.08 33.16,50.08 33.16,42.46 30.62,42.46
5V on Top Layer: 30.62,44.51 44.21,44.51 44.21,42.97 30.62,42.97
5V on Top Layer: 46.24,51.34 51.32,51.34 51.32,41.19 46.24,41.19
5V on Top Layer: 46.24,51.35 51.32,51.35 51.32,41.19 46.24,41.19
5V on Bottom Layer: 46.24,51.34 51.32,51.34 51.32,41.19 46.24,41.19
12V on Top Layer: 41.67,35.35 51.06,35.35 51.06,28.62 41.67,28.62
12V on Top Layer: 30.49,32.43 33.03,32.43 33.03,24.81 30.49,24.81
12V on Top Layer: 46.36,33.28 60.34,33.28 60.34,28.49 46.36,28.49
12V on Top Layer: 46.24,38.78 51.32,38.78 51.32,28.62 46.24,28.62
12V on Top Layer: 46.24,38.78 51.32,38.78 51.32,28.63 46.24,28.63
12V on Top Layer: 41.67,35.35 44.15,35.35 44.15,24.86 41.67,24.86
12V on Top Layer: 30.56,26.9 44.15,26.9 44.15,24.86 30.56,24.86
12V on Bottom Layer: 46.24,38.78 51.32,38.78 51.32,28.63 46.24,28.63
-12V on Top Layer: 46.24,12.87 51.32,12.87 51.32,2.71 46.24,2.71
-12V on Top Layer: 46.24,7.65 60.34,7.65 60.34,2.86 46.24,2.86
-12V on Top Layer: 36.12,7.73 41.63,7.73 41.63,5.57 36.12,5.57
-12V on Top Layer: 21.59,8.75 23.88,8.75 23.88,2.78 21.59,2.78
-12V on Top Layer: 46.24,12.87 51.32,12.87 51.32,2.72 46.24,2.72
-12V on Bottom Layer: 36.05,7.76 51.22,7.76 51.22,5.62 36.05,5.62
-12V on Bottom Layer: 46.24,12.87 51.32,12.87 51.32,2.72 46.24,2.72
GND on Top Layer: 30.62,15.67 33.16,15.67 33.16,8.05 30.62,8.05
GND on Top Layer: 35.71,42.72 41.67,42.72 41.67,40.43 35.71,40.43
GND on Top Layer: 21.52,28.72 23.89,28.72 23.89,23.03 21.52,23.03
GND on Top Layer: 35.65,24.56 41.16,24.56 41.16,22.4 35.65,22.4
GND on Top Layer: 30.68,10.08 43.13,10.08 43.13,8.04 30.68,8.04
GND on Top Layer: 17.47,45.81 18.37,45.81 18.37,43.3 17.47,43.3
GND on Top Layer: 17.47,45.81 22.82,45.81 22.82,44.7 17.47,44.7
GND on Top Layer: 21.6,26.17 23.89,26.17 23.89,20.2 21.6,20.2
GND on Top Layer: 21.59,45.81 23.96,45.81 23.96,39.88 21.59,39.88
GND on Top Layer: 17.39,28.72 18.17,28.72 18.17,26.59 17.39,26.59
GND on Top Layer: 17.39,28.72 22.75,28.72 22.75,27.73 17.39,27.73
GND on Top Layer: 46.24,25.83 51.32,25.83 51.32,15.67 46.24,15.67
GND on Top Layer: -1.13,53 64.02,53 64.02,-1.73 -1.13,-1.73
GND on Top Layer: 21.73,42.97 24.02,42.97 24.02,37 21.73,37
GND on Top Layer: 46.24,25.88 51.32,25.88 51.32,15.73 46.24,15.73
GND on Bottom Layer: 37.55,24.56 51.32,24.56 51.32,22.42 37.55,22.42
GND on Bottom Layer: -1.51,53.39 64.02,53.39 64.02,-1.99 -1.51,-1.99
GND on Bottom Layer: 46.24,25.82 51.32,25.82 51.32,15.67 46.24,15.67
VCC on Top Layer: 9.7,9.67 11.92,9.67 11.92,4.13 9.7,4.13
VCC on Top Layer: 7.76,43.99 11.89,43.99 11.89,4.19 7.76,4.19
VCC on Top Layer: 10.86,42.53 21.2,42.53 21.2,41.37 10.86,41.37
VCC on Top Layer: 10.79,25.85 21.14,25.85 21.14,24.55 10.79,24.55
VCC on Top Layer: 14.7,42.53 16.83,42.53 16.83,40.16 14.7,40.16
VCC on Top Layer: 14.63,25.85 16.76,25.85 16.76,23.47 14.63,23.47
$1N28 on Top Layer: 24.4,49.96 28.2,49.96 28.2,42.83 24.4,42.83
$1N33 on Top Layer: 24.65,41.19 32.74,41.19 32.74,40.2 24.65,40.2
$1N33 on Top Layer: 30.77,41.19 32.78,41.19 32.78,38.78 30.77,38.78
$1N4462 on Top Layer: 24.27,32.44 28.08,32.44 28.08,25.82 24.27,25.82
$1N4466 on Top Layer: 24.58,24.33 32.53,24.33 32.53,23.34 24.58,23.34
$1N4466 on Top Layer: 30.48,24.33 32.52,24.33 32.52,20.49 30.48,20.49
$1N5632 on Top Layer: 24.19,15.43 27.99,15.43 27.99,8.55 24.19,8.55
$1N5636 on Top Layer: 30.77,7.05 32.81,7.05 32.81,3.46 30.77,3.46
$1N5636 on Top Layer: 24.35,7.05 32.82,7.05 32.82,6.06 24.35,6.06
$1N5739 on Top Layer: 14.36,9.8 17.08,9.8 17.08,4.2 14.36,4.2
$1N5739 on Top Layer: 12.52,8.49 21.22,8.49 21.22,7.2 12.52,7.2
$1N5739 on Top Layer: 12.52,9.8 14.74,9.8 14.74,4.13 12.52,4.13

Small or netless copper shapes (teardrops, artwork), in the pictures only: 77 on Top Layer, 4 on Bottom Layer

## Text on the board
Bottom Silkscreen Layer: DCDC30-80输入转5V/12V/-12V输出 | 2025.6.2
Top Silkscreen Layer: -12V | GND | 12V | 5V | VCC
